# Altium schematic sheet AT89S52多功能板2.SchDoc
size A4
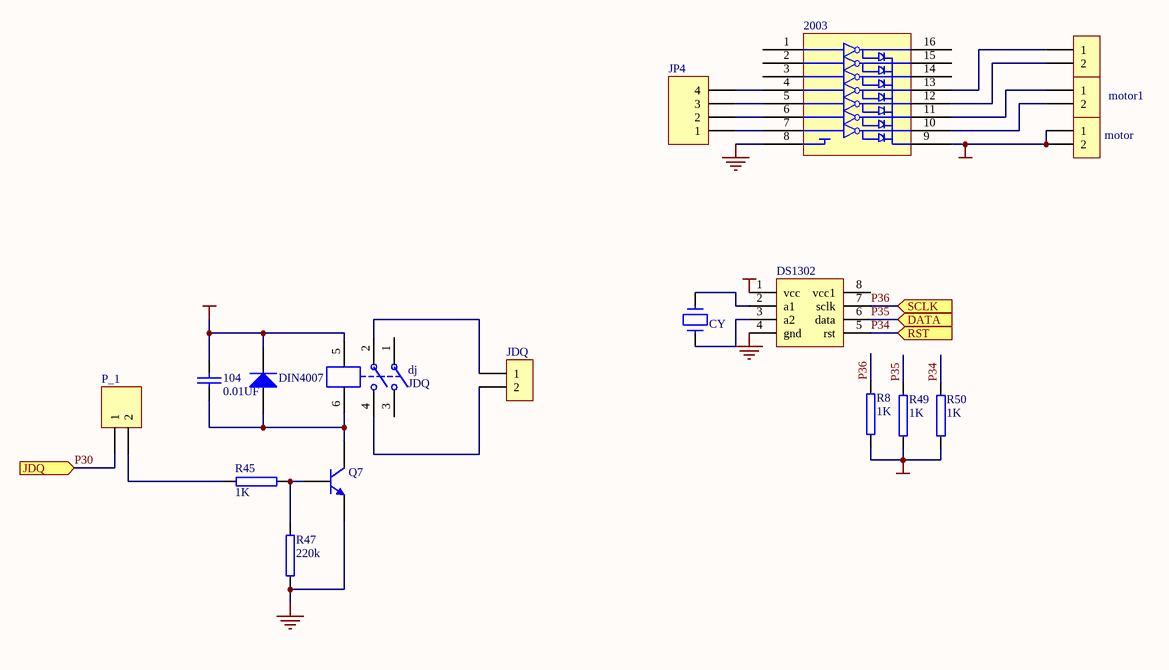
[diagram p0: AT89S52多功能板2.SchDoc]

## Parts
104  0.01UF  [RAD0.3]
121  CY  [CYPF]
2003  2003  [2003PF]  (value not drawn)
DIN4007  Diode 1N4007  [DO-41]  (value not drawn)
dj  JDQ  [JDQPF]
DS1302  DS1302  [DIP8]  (value not drawn)
JDQ  POWER  [POWERPF]  (value not drawn)
JP4  Header 4  [HDR1X4]  (value not drawn)
motor  POWER  [POWERPF]  (value not drawn)
motor1  POWER  [POWERPF]  (value not drawn)
motor3  POWER  [POWERPF]  (value not drawn)
P_1  Header 2  [HDR1X2]  (value not drawn)
Q7  2N3904  [TO-92A]  (value not drawn)
R8  1K  [RES1PF]
R45  1K  [RES1PF]
R47  220k  [AXIAL0.4]
R49  1K  [RES1PF]
R50  1K  [RES1PF]

## Ports
DATA (in), JDQ (in), RST (in), SCLK (in)

## Nets
GND: 2003.8 DS1302.4(gnd) Q7.1(E) R47.1
VCC: 104.1 2003.9 DIN4007.2(K) dj.5 DS1302.1(vcc) motor.1 motor.2 R8.2 R49.2 R50.2
P30: P_1.1 ; port JDQ
P34: DS1302.5(rst) R50.1 ; port RST
P35: DS1302.6(data) R49.1 ; port DATA
P36: DS1302.7(sclk) R8.1 ; port SCLK
Net104_2: 104.2 DIN4007.1(A) dj.6 Q7.3(C)
Net121_1: 121.1 DS1302.3(a2)
Net121_2: 121.2 DS1302.2(a1)
Net2003_4: 2003.4 JP4.4
Net2003_5: 2003.5 JP4.3
Net2003_6: 2003.6 JP4.2
Net2003_7: 2003.7 JP4.1
Net2003_10: 2003.10 motor1.2
Net2003_11: 2003.11 motor1.1
Net2003_12: 2003.12 motor3.2
Net2003_13: 2003.13 motor3.1
Netdj_2: dj.2 JDQ.1
Netdj_4: dj.4 JDQ.2
NetP_1_2: P_1.2 R45.2
NetQ7_2: Q7.2(B) R45.1 R47.2

Not connected (* = marked no-connect by the designer): 2003 1 2 3 14 15 16; dj 1 3; DS1302 8(vcc1)

## Library data of the parts
104 = CAP: Capacitor
DIN4007 = Diode 1N4007: 1 Amp General Purpose Rectifier; Published: 8-Jun-2000; LatestRevisionDate: 17-Jul-2002; LatestRevisionNote: Re-released for DXP Platform.; DatasheetDocument: 1998; PackageDocument: Aug-1999; PackageReference: DO-41; Publisher: Altium Limited; Code_JEDEC: DO-204-AL; ComponentLink1Description: Manufacturer Link; ComponentLink1URL: http://www.fairchildsemi.com/; ComponentLink2Description: Datasheet; ComponentLink2URL: http://www.fairchildsemi.com/ds/1N%2F1N4001.pdf
JP4 = Header 4: Header, 4-Pin; Revision: 17-Jul-2002: Re-released for DXP Platform.; Publisher: Altium Limited
P_1 = Header 2: Header, 2-Pin; Revision: 17-Jul-2002: Re-released for DXP Platform.; Publisher: Altium Limited
Q7 = 2N3904: NPN General Purpose Amplifier; Published: 8-Jun-2000; LatestRevisionDate: 15-Jan-2003; LatestRevisionNote: PCB Footprint 'BCY-W3/D4.7' replaced; DatasheetDocument: 1997; PackageDocument: Sep-1998; PackageReference: TO-92A; Publisher: Altium Limited; Code_JEDEC: TO-92A; ComponentLink1Description: Manufacturer Link; ComponentLink1URL: http://www.fairchildsemi.com/; ComponentLink2Description: Datasheet; ComponentLink2URL: http://www.fairchildsemi.com/ds/2N%2F2N3904.pdf
R8 R45 R49 R50 = RES1
R47 = RES2